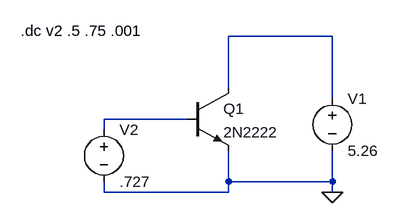
[diagram p0: schematic 2n222.asc]
2n222.asc, the LTspice schematic file:
Version 4
SHEET 1 880 680
WIRE 384 80 224 80
WIRE 224 160 224 80
WIRE 384 176 384 80
WIRE 160 208 32 208
WIRE 32 224 32 208
WIRE 224 304 224 256
WIRE 384 304 384 256
WIRE 384 304 224 304
WIRE 32 320 32 304
WIRE 224 320 224 304
WIRE 224 320 32 320
WIRE 384 320 384 304
FLAG 384 320 0
SYMBOL npn 160 160 R0
SYMATTR InstName Q1
SYMATTR Value 2N2222
SYMBOL voltage 384 160 R0
WINDOW 123 0 0 Left 2
WINDOW 39 0 0 Left 2
SYMATTR InstName V1
SYMATTR Value 5.26
SYMBOL voltage 32 208 R0
WINDOW 123 0 0 Left 2
WINDOW 39 0 0 Left 2
SYMATTR InstName V2
SYMATTR Value .727
TEXT -96 72 Left 2 !.dc v2 .5 .75 .001

The netlist it stands for:
* 2n222.asc
Q1 N001 N002 0 0 2N2222
V1 N001 0 5.26
V2 N002 0 .727
.model NPN NPN
.model PNP PNP
.lib standard.bjt
.dc v2 .5 .75 .001
.backanno
.end